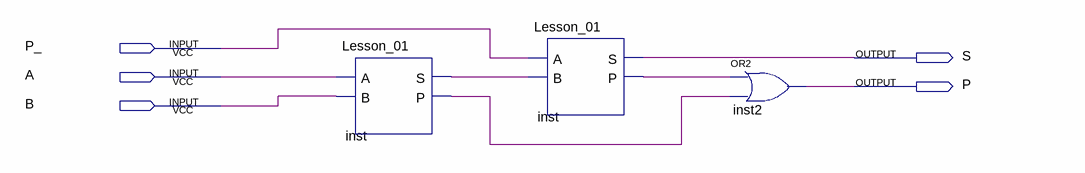
[diagram p0: schematic sheet]
// Quartus schematic FullAdder.bdf as structural Verilog: 3 symbols, 5 pins
module FullAdder (
  input  P_,
  input  A,
  input  B,
  output S,
  output P
);

  wire inst_p, inst_p_2, inst_s;

  Lesson_01 inst (.A(A), .B(B), .S(inst_s), .P(inst_p_2));
  Lesson_01 inst_dup2 (.A(P_), .B(inst_s), .S(S), .P(inst_p));
  or inst2 (P, inst_p, inst_p_2);
endmodule
